# Altium schematic sheet Digital and Aux Power.SchDoc
size A
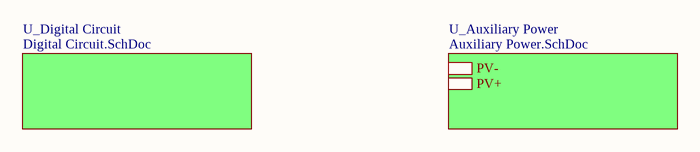
[diagram p0: Digital and Aux Power.SchDoc]

## Sub-sheets
U_Auxiliary Power = Auxiliary Power.SchDoc: PV-, PV+
U_Digital Circuit = Digital Circuit.SchDoc: no entries